# Altium schematic sheet Power4.SchDoc
size A3
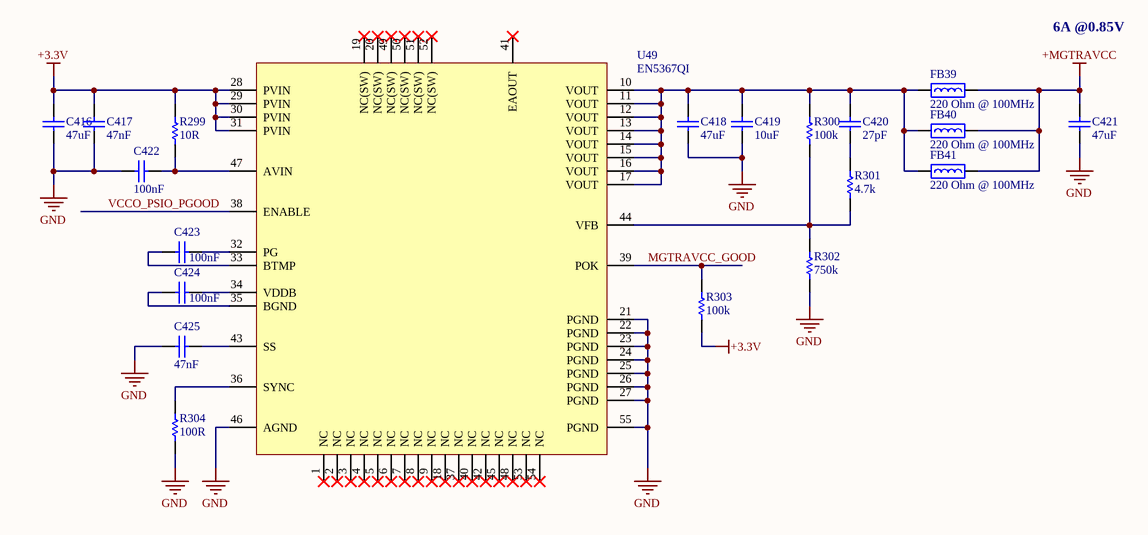
[diagram p0: Power4.SchDoc]

## Parts
C416  47uF  [CAPC3216L_1206]
C417  47nF  [CAPC2012L_0805]
C418  47uF  [CAPC3216L_1206]
C419  10uF  [CAPC1005L_0402]
C420  27pF  [CAPC1005L_0402]
C421  47uF  [CAPC3216L_1206]
C422  100nF  [CAPC1005L_0402]
C423  100nF  [CAPC1005L_0402]
C424  100nF  [CAPC1005L_0402]
C425  47nF  [CAPC2012L_0805]
FB39  Impedance @ Frequency: 220 Ohm @ 100MHz  [INDC1608N_0603]  (hidden comment: BEAD0603_220_2A5_40M)
FB40  Impedance @ Frequency: 220 Ohm @ 100MHz  [INDC1608N_0603]  (hidden comment: BEAD0603_220_2A5_40M)
FB41  Impedance @ Frequency: 220 Ohm @ 100MHz  [INDC1608N_0603]  (hidden comment: BEAD0603_220_2A5_40M)
R299  value 10R  [RESC1005L_0402]  (hidden comment: RES0402_10R_0W1_1T)
R300  value 100k  [RESC1005L_0402]  (hidden comment: RES0402_100K_0W2_1T)
R301  value 4.7k  [RESC1005L_0402]  (hidden comment: RES0402_4K7_0W1_1T)
R302  value 750k  [RESC1005L_0402]  (hidden comment: RES0402_750K_0W1_1T)
R303  value 100k  [RESC1005L_0402]  (hidden comment: RES0402_100K_0W2_1T)
R304  value 100R  [RESC1005L_0402]  (hidden comment: RES0402_100R_0W1_1T)
U49  EN5367QI  [QFN54-EN5367QI]

## Nets
+3.3V: C416.2 C417.2 R299.2 R303.2 U49.28(PVIN) U49.29(PVIN) U49.30(PVIN) U49.31(PVIN)
+MGTRAVCC: C421.2 FB39.2 FB40.2 FB41.2
GND: C416.1 C417.1 C418.1 C419.1 C421.1 C422.2 C425.2 R302.1 R304.2 U49.21(PGND) U49.22(PGND) U49.23(PGND) U49.24(PGND) U49.25(PGND) U49.26(PGND) U49.27(PGND) U49.46(AGND) U49.55(PGND)
MGTRAVCC_GOOD: R303.1 U49.39(POK)
VCCO_PSIO_PGOOD: U49.38(ENABLE)
NetC418_2: C418.2 C419.2 C420.2 FB39.1 FB40.1 FB41.1 R300.2 U49.10(VOUT) U49.11(VOUT) U49.12(VOUT) U49.13(VOUT) U49.14(VOUT) U49.15(VOUT) U49.16(VOUT) U49.17(VOUT)
NetC420_1: C420.1 R301.2
NetC422_1: C422.1 R299.1 U49.47(AVIN)
NetC423_1: C423.1 U49.32(PG)
NetC423_2: C423.2 U49.33(BTMP)
NetC424_1: C424.1 U49.34(VDDB)
NetC424_2: C424.2 U49.35(BGND)
NetC425_1: C425.1 U49.43(SS)
NetR300_1: R300.1 R301.1 R302.2 U49.44(VFB)
NetR304_1: R304.1 U49.36(SYNC)

Not connected (* = marked no-connect by the designer): U49 1(NC)* 2(NC)* 3(NC)* 4(NC)* 5(NC)* 6(NC)* 7(NC)* 8(NC)* 9(NC)* 18(NC)* 19(NC(SW))* 20(NC(SW))* 37(NC)* 40(NC)* 41(EAOUT)* 42(NC)* 45(NC)* 48(NC)* 49(NC(SW))* 50(NC(SW))* 51(NC(SW))* 52(NC(SW))* 53(NC)* 54(NC)*

## Notes on the sheet
- 6A @0.85V

## Library data of the parts
C416 C418 C421 = CAPCER1206X5R47U25V_20T: CAP CER 47UF 25V X5R 1206; Manufacturer 1: TDK Corporation; Manufacturer Part Number 1: C3216X5R1E476M160AC; Tolerance: 20%; Package: 1206; ComponentLink1Description: Datasheet; Value: 47uF; Voltage: 25V; Temperature Coefficient: X5R; Supplier 1: Digi-Key; Supplier Part Number 1: 445-8047-1-ND; Operating Temperature: -55°C ~ 85°C
C417 C425 = CAPCER0805X5R47N50V_10T: CAP CER 0.047UF 50V X7R 0805; Manufacturer 1: Kemet; Manufacturer Part Number 1: C0805C473K5RACTU; Tolerance: 10%; Package: 0805; ComponentLink1Description: Datasheet; Value: 47nF; Voltage: 50V; Temperature Coefficient: X7R; Supplier 1: Digi-Key; Supplier Part Number 1: 399-1166-1-ND; Operating Temperature: -55°C ~ 125°C
C419 = CAPCER0402X5R10U10V_20T: CAP CER 10UF 10V X5R 0402; Manufacturer 1: Samsung Electro-Mechanics America, Inc.; Manufacturer Part Number 1: CL05A106MP5NUNC; Tolerance: 20%; Package: 0402; ComponentLink1Description: Datasheet; Value: 10uF; Voltage: 10V; Temperature Coefficient: X5R; Supplier 1: Digi-Key; Supplier Part Number 1: 1276-1450-1-ND; Operating Temperature: -55°C ~ 85°C
C420 = CAPCER0402C0G27P50V_5T: CAP CER 27PF 50V C0G/NP0 0402; Manufacturer 1: Murata Electronics North America; Manufacturer Part Number 1: GRM1555C1H270JA01D; Tolerance: 5%; Package: 0402; ComponentLink1Description: Datasheet; Value: 27pF; Voltage: 50V; Temperature Coefficient: C0G/NP0; Supplier 1: Digi-Key; Supplier Part Number 1: 490-5869-1-ND; Operating Temperature: -55°C ~ 125°C
C422-C424 = CAPCER0402X7R100N25V_10T: CAP CER 0.1UF 25V X7R 0402; Manufacturer 1: Murata Electronics North America; Manufacturer Part Number 1: GRM155R71E104KE14D; Tolerance: 10%; Package: 0402; ComponentLink1Description: Datasheet; Value: 100nF; Voltage: 25V; Temperature Coefficient: X7R; Supplier 1: Digi-Key; Supplier Part Number 1: 490-10698-1-ND; Operating Temperature: -55°C ~ 125°C
FB39-FB41 = BEAD0603_220_2A5_40M: FERRITE BEAD 220 OHM 0603 1LN; Manufacturer 1: Murata Electronics North America; Manufacturer Part Number 1: BLM18SG221TN1D; Current Rating (Max): 2.5A; DC Resistance (DCR) (Max): 40 mohm; Package: 0603; ComponentLink1Description: Datasheet; ComponentLink1URL: C:\Users\Public\Documents\Altium\AD16\Library\PDF\ENFA0003.pdf; Supplier 1: Digi-Key; Supplier Part Number 1: 490-5225-1-ND; Operating Temperature: -55°C ~ 125°C
R299 = RES0402_10R_0W1_1T: RES SMD 10 OHM 1% 1/10W 0402; Manufacturer 1: Panasonic Electronic Components; Manufacturer Part Number 1: ERJ-2RKF10R0X; Package: 0402; ComponentLink1Description: Datasheet; Power: 1/10W; Tolerance: 1%; Supplier 1: Digi-Key; Supplier Part Number 1: P10.0LCT-ND
R300 R303 = RES0402_100K_0W2_1T: RES SMD 100K OHM 1% 1/5W 0402; Manufacturer 1: Vishay Dale; Manufacturer Part Number 1: RCS0402100KFKED; Package: 0402; ComponentLink1Description: Datasheet; Power: 1/5W; Tolerance: 1%; Supplier 1: Digi-Key; Supplier Part Number 1: 541-2899-1-ND
R301 = RES0402_4K7_0W1_1T: RES SMD 4.7K OHM 1% 1/10W 0402; Manufacturer 1: Panasonic Electronic Components; Manufacturer Part Number 1: ERJ-2RKF4701X; Package: 0402; ComponentLink1Description: Datasheet; Power: 1/10W; Tolerance: 1%; Supplier 1: Digi-Key; Supplier Part Number 1: P4.70KLCT-ND
R302 = RES0402_750K_0W1_1T: RES SMD 750K OHM 1% 1/10W 0402; Manufacturer 1: Panasonic Electronic Components; Manufacturer Part Number 1: ERJ-2RKF7503X; Package: 0402; ComponentLink1Description: Datasheet; Power: 1/10W; Tolerance: 1%; Supplier 1: Digi-Key; Supplier Part Number 1: P750KLCT-ND
R304 = RES0402_100R_0W1_1T: RES SMD 100 OHM 1% 1/10W 0402; Manufacturer 1: Panasonic Electronic Components; Manufacturer Part Number 1: ERJ-2RKF1000X; Package: 0402; ComponentLink1Description: Datasheet; Power: 1/10W; Tolerance: 1%; Supplier 1: Digi-Key; Supplier Part Number 1: P100LCT-ND
U49 = EN5367QI: DC/DC CONVERTER 0.6-4.9V 29W; Manufacturer 1: Altera; Voltage - Output: 0.6 ~ 4.9 V; Voltage - Input: 2.5V - 5.5V; ComponentLink1Description: Datasheet; ComponentLink1URL: C:\Users\Public\Documents\Altium\AD16\Library\PDF\en5367qi_07013.pdf; Supplier 1: Digi-Key; Supplier Part Number 1: 544-2858-1-ND; Manufacturer Part Number 1: EN5367QI; Operating Temperature: -40°C ~ 85°C